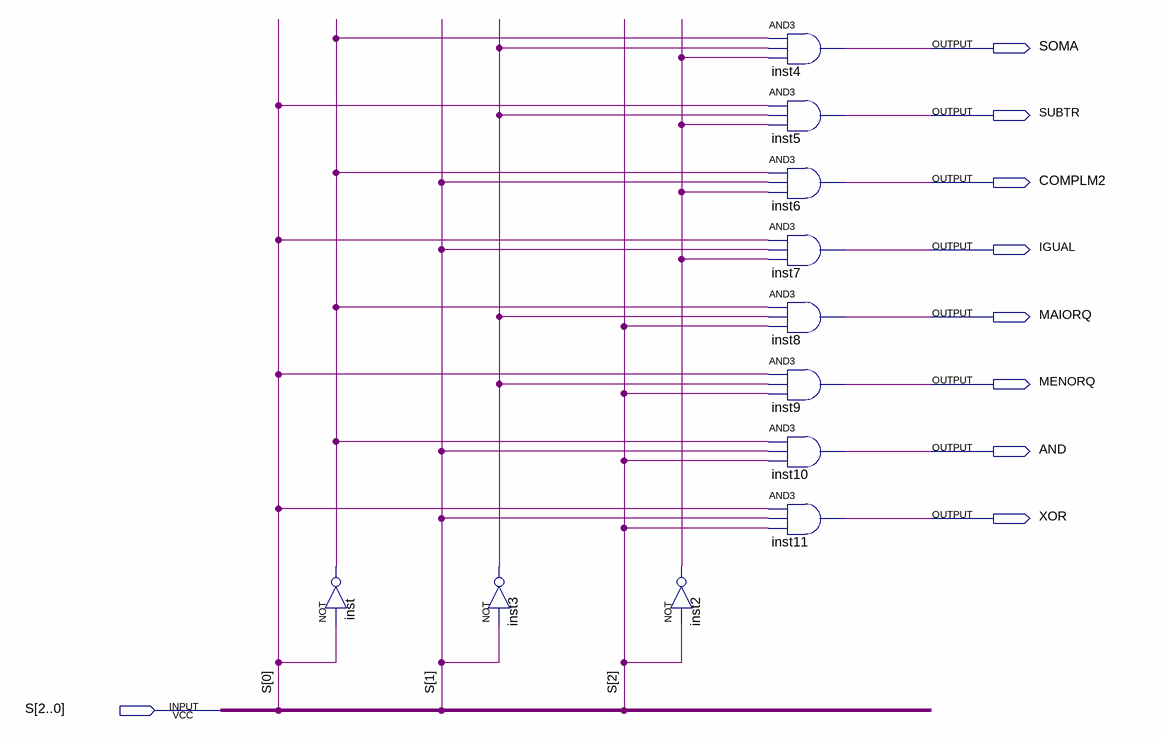
[diagram p0: schematic sheet]
// Quartus schematic Seletor.bdf as structural Verilog: 11 symbols, 9 pins
module Seletor (
  input  [2:0] S,
  output SOMA,
  output SUBTR,
  output COMPLM2,
  output IGUAL,
  output MAIORQ,
  output MENORQ,
  output AND,
  output XOR
);

  wire inst2_out, inst3_out, inst_out;

  not inst (inst_out, S[0]);
  not inst3 (inst3_out, S[1]);
  not inst2 (inst2_out, S[2]);
  and inst4 (SOMA, inst_out, inst3_out, inst2_out);
  and inst5 (SUBTR, S[0], inst3_out, inst2_out);
  and inst6 (COMPLM2, inst_out, S[1], inst2_out);
  and inst7 (IGUAL, S[0], S[1], inst2_out);
  and inst8 (MAIORQ, inst_out, inst3_out, S[2]);
  and inst9 (MENORQ, S[0], inst3_out, S[2]);
  and inst10 (AND, inst_out, S[1], S[2]);
  and inst11 (XOR, S[0], S[1], S[2]);
endmodule
